# EAGLE design breadboard-lipo-switch (EAGLE 7.3.0)
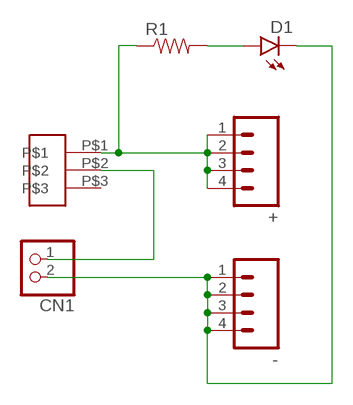
[diagram p0: schematic, sheet 1]

## Parts
+  M04PTH  [1X04]
-  M04PTH  [1X04]
CN1  JST_2PIN-SMT-RA  [JST-PH-2-SMT-RA]
D1  LED0603  [LED-0603]
R1  RESISTOR0603-RES  [0603-RES]
U$1  OS102-SPDT-SWITCH  [OS102-SPDT-SWITCH]

## Nets
GND: -.1 -.2 -.3 -.4 CN1.2 D1.C
N$1: D1.A R1.2
VCC: +.1 +.2 +.3 +.4 R1.1 U$1.P$1
VIN: CN1.1 U$1.P$2
Unconnected: U$1.P$3

## Library data of the parts
+ - = SparkFun-Connectors:M04: Header 4 Standard 4-pin 0.1" header. Use with straight break away headers (SKU : PRT-00116), right angle break away headers (PRT-00553), swiss pins (PRT-00743), machine pins (PRT-00117), and female headers (PRT-00115). Molex polarized connector foot print use with SKU : PRT-08231 with associated crimp pins and housings. 1MM SMD Version SKU: PRT-10208
CN1 = adafruit:JST_2PIN: JST 2-Pin Connectors of various flavors SMT-RA (S2B-PH-SM4) 4UConnector #17311 SMT (B2B-PH-SM4) THM-RA (S2B-PH) THM (B2B-PH)
D1 = SparkFun-LED:LED: LEDs Standard schematic elements and footprints for 5mm, 3mm, 1206, and 0603 sized LEDs. 5mm - Spark Fun Electronics SKU : COM-00529 (and others)
R1 = SparkFun-Passives:RESISTOR: Resistor Basic schematic elements and footprints for 0603, 1206, and PTH resistors.
U$1 = awqua_eagle_library:OS102-SPDT-SWITCH

## Board
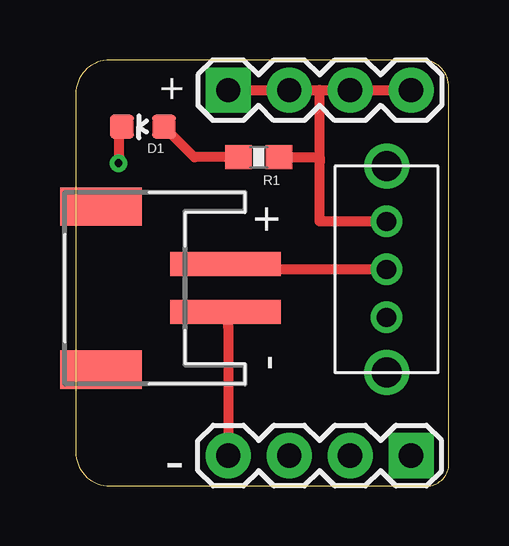
[diagram p1: board, top side]
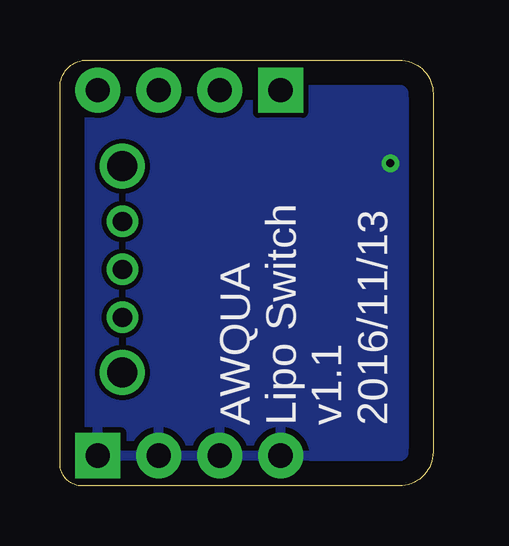
[diagram p2: board, bottom side, seen from below]

Size 15.54 x 17.77 mm. Coordinates in mm from the lower left corner, seen from the top.
Outline: 0,16.36 0,1.42 arc90 1.42,0 14.61,0 arc90 15.54,0.94 15.54,16.64 arc90 14.42,17.77 1.41,17.77 arc90 0,16.36
Copper layers (1*16): Top 0.035mm / dielectric 1.5mm / Bottom 0.035mm
Design rules "default *": minimum track width 10mil, minimum drill 24mil, track to track 8mil, track to pad 8mil, pad to pad 8mil, via to via 8mil, smd to smd 8mil, copper to edge 40mil, drill to drill 8mil, minimum pad ring 10mil, minimum via ring 8mil, stop-mask expansion 4mil, vias tented up to drill 13mil, thermal gap 10mil

### Footprints (pad centres in the part's own frame; a part is rotated, then mirrored left to right if it is on the bottom)
1X04 = drill 1.016 pad 1.88 square: 1 0,0 | drill 1.016 pad 1.88: 2 2.54,0; 3 5.08,0; 4 7.62,0
JST-PH-2-SMT-RA = smd 1 x 4.6: 1 1,-3.7; 2 -1,-3.7 | smd 1.6 x 3.4: NC1 -3.4,1.5; NC2 3.4,1.5
LED-0603 = smd 1 x 1: A 0,-0.877; C 0,0.877
0603-RES = smd 1.1 x 1: 1 -0.85,0; 2 0.85,0
OS102-SPDT-SWITCH = drill 1.25: ANCHOR1 0,2.15; ANCHOR2 8.6,2.15 | drill 0.8: P$1 2.3,2.15; P$2 4.3,2.15; P$3 6.3,2.15

### Placement (x,y rotation side)
+  6.35,16.51 0 top
-  13.97,1.27 180 top
CN1  2.54,8.26 90 top
D1  2.79,14.99 90 top
R1  7.62,13.72 180 top
U$1  10.79,13.34 270 top

### Tracks (layer width: path | path; a pad name or v marks a point on that pad's centre or on a via)
GND  (via drill 0.33)
  Top 0.406: CN1.2 6.35,6.62 -.4 | D1.C 1.78,14.99 v1.78,13.46
  pour Bottom: -2.54,20.95 19.68,20.95 19.68,-5.08 -2.54,-5.08
N$1
  Top 0.406: R1.2 4.94,13.72 D1.A
VCC
  Top 0.406: +.1 +.2 10.16,16.51 | 10.16,16.51 +.3 +.4 14.61,16.51 | 10.16,13.72 10.16,16.51 | R1.1 10.16,13.72 | U$1.P$1 10.16,11.04 10.16,13.46 10.16,13.72
VIN
  Top 0.406: U$1.P$2 6.24,9.04 CN1.1

### Text on the board
bPlace: AWQUA / Lipo Switch / v1.1 / 2016/11/13